# EAGLE design Mbus_1.3 (EAGLE 9.6.2)
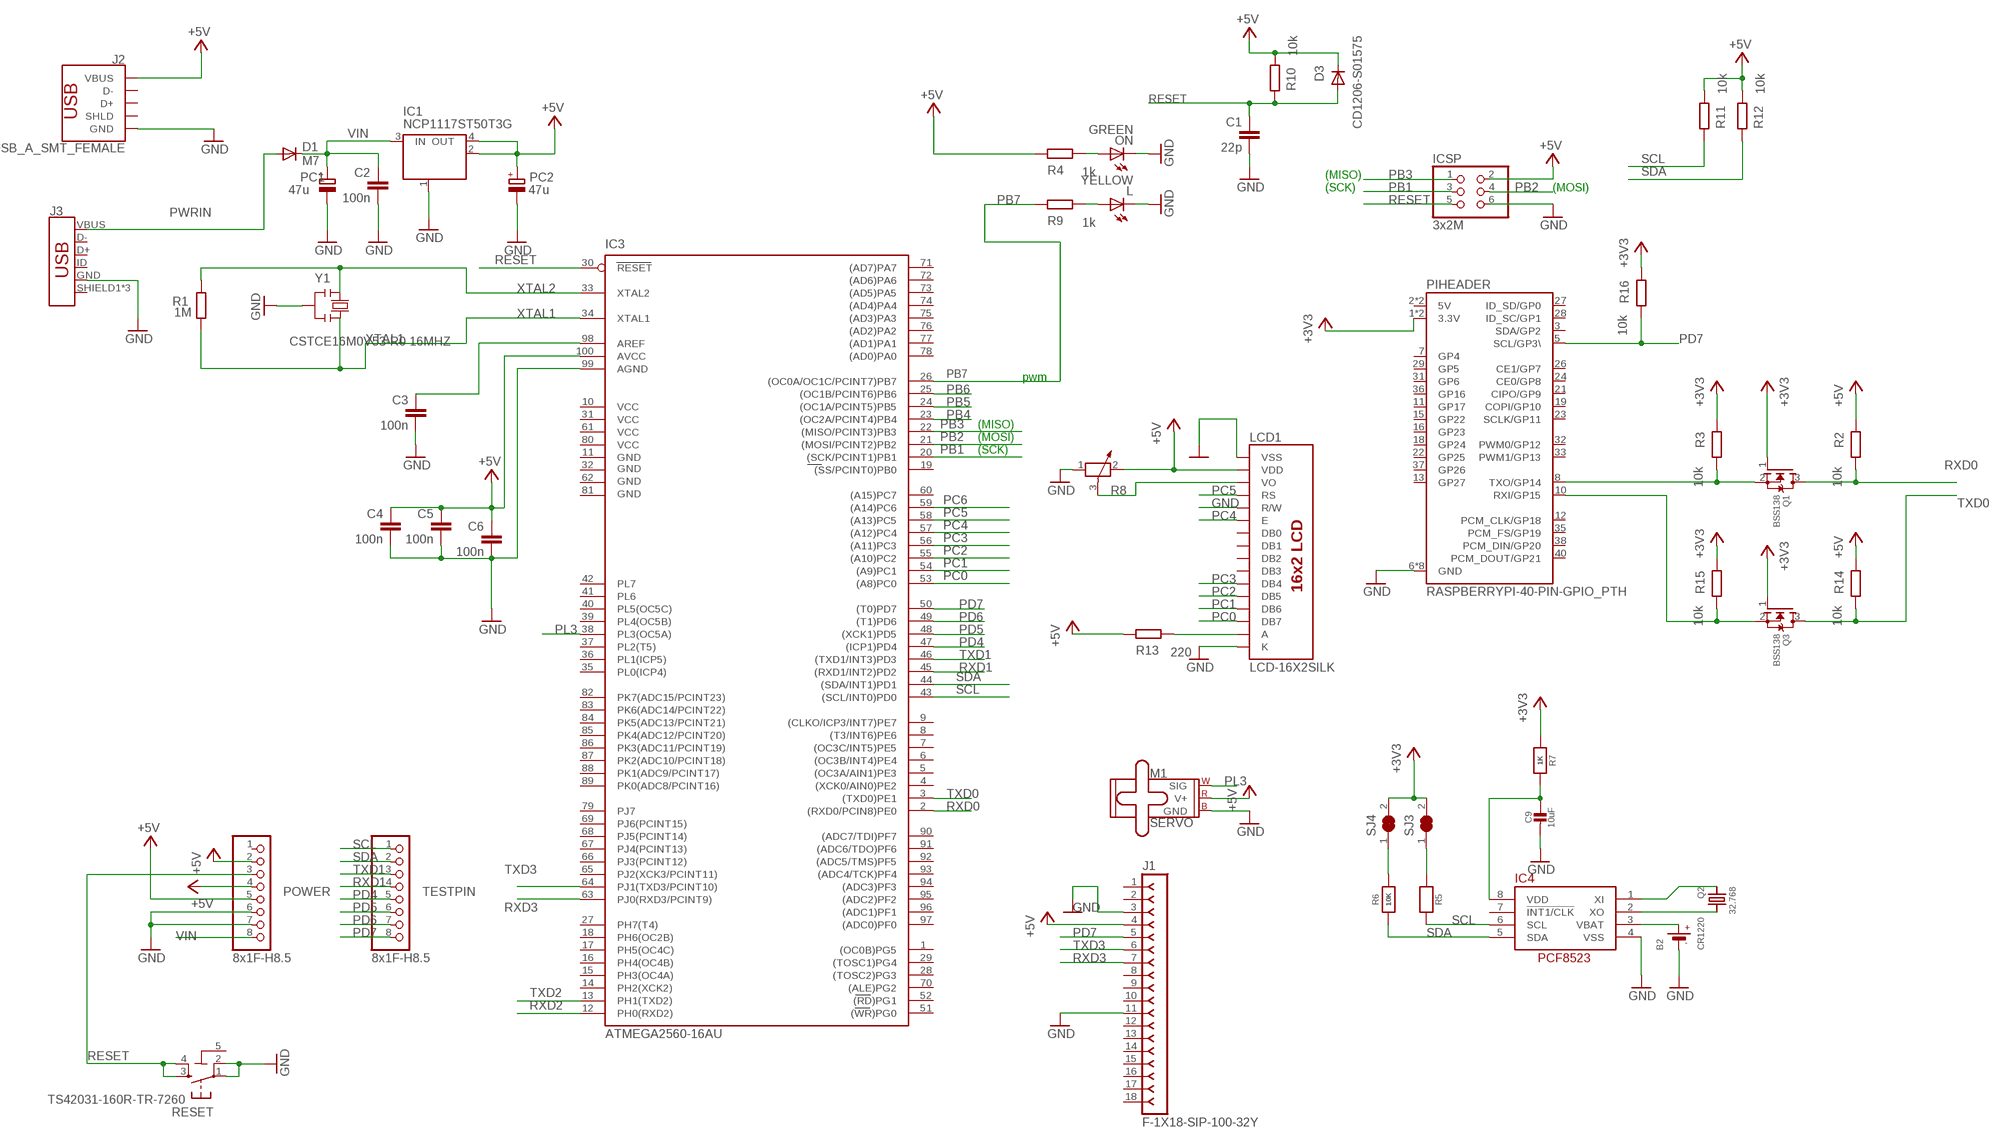
[diagram p0: schematic, sheet 1]

## Parts
B2  CR1220  BATTERYCR1220_SMT  [CR1220]
C1  22p  C-EU0603-RND  [C0603-ROUND]
C2  100n  C-EU0603-RND  [C0603-ROUND]
C3  100n  C-EU0603-RND  [C0603-ROUND]
C4  100n  C-EU0603-RND  [C0603-ROUND]
C5  100n  C-EU0603-RND  [C0603-ROUND]
C6  100n  C-EU0603-RND  [C0603-ROUND]
C9  10uF  CAP_CERAMIC0805-NOOUTLINE  [0805-NO]
D1  M7  DIODE-SMB  [SMB]
D3  CD1206-S01575  DIODE-MINIMELF  [MINIMELF]
IC1  NCP1117ST50T3G  MC33269ST-3.3T3  [SOT223]
IC3  ATMEGA2560-16AU  ATMEGA25602560-16AU  [TQFP100]
IC4  RTC_PCF8523T  [SOIC8_150MIL]
ICSP  3x2M  PINHD-2X3  [2X03]
J1  F-1X18-SIP-100-32Y  [SIP-100-18-32Y]
J2  USB_A_SMT_FEMALE  [USB-A-S-SILK-FEMALE]
J3  USB_MICRO-B_FEMALE-SMT  [USB-B-MICRO-SMD]
L  YELLOW  LEDCHIP-LED0805  [CHIP-LED0805]
LCD1  LCD-16X2SILK  [LCD-16X2]
M1  SERVO  [1X03]
ON  GREEN  LEDCHIP-LED0805  [CHIP-LED0805]
PC1  47u  CPOL-EUD  [PANASONIC_D]
PC2  47u  CPOL-EUD  [PANASONIC_D]
PIHEADER  RASPBERRYPI-40-PIN-GPIO_PTH  [2X20_SHROUDED]
POWER  8x1F-H8.5  PINHD-1X8  [1X08]
Q1  BSS138  MOSFET-NREFLOW  [SOT23]
Q2  32.768  CRYSTAL8.0X3.8  [CRYSTAL_8X3.8]
Q3  BSS138  MOSFET-NREFLOW  [SOT23]
R1  1M  R-EU_R0603  [R0603-ROUND]
R2  10k  R-EU_R0603  [R0603-ROUND]
R3  10k  R-EU_R0603  [R0603-ROUND]
R4  1k  R-EU_R0603  [R0603-ROUND]
R5  10K  RESISTOR0805_NOOUTLINE  [0805-NO]
R6  10K  RESISTOR0805_NOOUTLINE  [0805-NO]
R7  1K  RESISTOR0805_NOOUTLINE  [0805-NO]
R8  POTENTIOMETER_PT-10  [PT-10]
R9  1k  R-EU_R0603  [R0603-ROUND]
R10  10k  R-EU_R0603  [R0603-ROUND]
R11  10k  R-EU_R0603  [R0603-ROUND]
R12  10k  R-EU_R0603  [R0603-ROUND]
R13  220  R-EU_R0603  [R0603-ROUND]
R14  10k  R-EU_R0603  [R0603-ROUND]
R15  10k  R-EU_R0603  [R0603-ROUND]
R16  10k  R-EU_R0603  [R0603-ROUND]
RESET  TS42031-160R-TR-7260  TS42  [TS42]
SJ3  SOLDERJUMPER_CLOSED  [SOLDERJUMPER_CLOSEDWIRE]
SJ4  SOLDERJUMPER_CLOSED  [SOLDERJUMPER_CLOSEDWIRE]
TESTPIN  8x1F-H8.5  PINHD-1X8  [1X08]
Y1  CSTCE16M0V53-R0 16MHZ  RESONATORMU  [RESONATOR]

## Nets
+3V3: PIHEADER.1(3.3V) PIHEADER.17(3.3V) Q1.1(G) Q3.1(G) R3.2 R7.1 R15.2 R16.2 SJ3.2 SJ4.2
+5V [power usb]: C4.1 C5.1 C6.1 D3.C IC1.2(OUT) IC1.4(OUT) IC3.100(AVCC) ICSP.2 J1.4 J2.VBUS LCD1.2(VDD) M1.2(V+) PC2.+ POWER.2 POWER.4 POWER.5 R2.2 R4.2 R8.2 R10.1 R11.1 R12.1 R13.2 R14.2
AREF: C3.1 IC3.98(AREF)
GND [gnd]: B2.- C1.2 C2.2 C3.2 C4.2 C5.2 C6.2 C9.2 IC1.1(GND/ADJ) IC3.99(AGND) IC4.4(VSS) ICSP.6 J1.3 J1.11 J2.GND J3.GND L.C LCD1.1(VSS) LCD1.5(R/W) LCD1.16(K) M1.3(GND) ON.C PC1.- PC2.- PIHEADER.6(GND) PIHEADER.9(GND) PIHEADER.14(GND) PIHEADER.20(GND) PIHEADER.25(GND) PIHEADER.30(GND) PIHEADER.34(GND) PIHEADER.39(GND) POWER.6 POWER.7 R8.1 RESET.1 RESET.2 Y1.2
N$2: L.A R9.1
N$3: ON.A R4.1
N$6: IC4.1(XI) Q2.P$1
N$7: IC4.2(XO) Q2.P$4
N$8: R5.1 SJ3.1
N$9: R6.2 SJ4.1
N$10: C9.1 IC4.8(VDD) R7.2
N$11: LCD1.15(A) R13.1
N$22: LCD1.3(VO) R8.3
PB1: IC3.20((SCK/PCINT1)PB1) ICSP.3
PB2: IC3.21((MOSI/PCINT2)PB2) ICSP.4
PB3: IC3.22((MISO/PCINT3)PB3) ICSP.1
PB4: IC3.23((OC2A/PCINT4)PB4)
PB5: IC3.24((OC1A/PCINT5)PB5)
PB6: IC3.25((OC1B/PCINT6)PB6)
PB7: IC3.26((OC0A/OC1C/PCINT7)PB7) R9.2
PC0: IC3.53((A8)PC0) LCD1.14(DB7)
PC1: IC3.54((A9)PC1) LCD1.13(DB6)
PC2: IC3.55((A10)PC2) LCD1.12(DB5)
PC3: IC3.56((A11)PC3) LCD1.11(DB4)
PC4: IC3.57((A12)PC4) LCD1.6(E)
PC5: IC3.58((A13)PC5) LCD1.4(RS)
PC6: IC3.59((A14)PC6)
PD4: IC3.47((ICP1)PD4) TESTPIN.5
PD5: IC3.48((XCK1)PD5) TESTPIN.6
PD6: IC3.49((T1)PD6) TESTPIN.7
PD7: IC3.50((T0)PD7) J1.5 PIHEADER.5(SCL/GP3\) R16.1 TESTPIN.8
PL3: IC3.38(PL3(OC5A)) M1.1(SIG)
PWRIN [power]: D1.A J3.VBUS
RESET: C1.1 D3.A IC3.30(RESET) ICSP.5 POWER.3 R10.2 RESET.3 RESET.4
RXD0: IC3.2((RXD0/PCIN8)PE0) PIHEADER.10(RXI/GP15) Q1.3(D) Q3.2(S) R2.1 R15.1
RXD1: IC3.45((RXD1/INT2)PD2) TESTPIN.4
RXD2: IC3.12(PH0(RXD2))
RXD3: IC3.63(PJ0(RXD3/PCINT9)) J1.7
SCL: IC3.43((SCL/INT0)PD0) IC4.6(SCL) R5.2 R11.2 TESTPIN.1
SDA: IC3.44((SDA/INT1)PD1) IC4.5(SDA) R6.1 R12.2 TESTPIN.2
TXD0: IC3.3((TXD0)PE1) PIHEADER.8(TXO/GP14) Q1.2(S) Q3.3(D) R3.1 R14.1
TXD1: IC3.46((TXD1/INT3)PD3) TESTPIN.3
TXD2: IC3.13(PH1(TXD2))
TXD3: IC3.64(PJ1(TXD3/PCINT10)) J1.6
VBAT1: B2.+$1(+) IC4.3(VBAT)
VIN [power]: C2.1 D1.C IC1.3(IN) PC1.+ POWER.8
XTAL1: IC3.34(XTAL1) R1.1 Y1.3
XTAL2: IC3.33(XTAL2) R1.2 Y1.1
Unconnected: IC3.1((OC0B)PG5) IC3.4((XCK0/AIN0)PE2) IC3.5((OC3A/AIN1)PE3) IC3.6((OC3B/INT4)PE4) IC3.7((OC3C/INT5)PE5) IC3.8((T3/INT6)PE6) IC3.9((CLKO/ICP3/INT7)PE7) IC3.14(PH2(XCK2)) IC3.15(PH3(OC4A)) IC3.16(PH4(OC4B)) IC3.17(PH5(OC4C)) IC3.18(PH6(OC2B)) IC3.19((SS/PCINT0)PB0) IC3.27(PH7(T4)) IC3.28((TOSC2)PG3) IC3.29((TOSC1)PG4) IC3.35(PL0(ICP4)) IC3.36(PL1(ICP5)) IC3.37(PL2(T5)) IC3.39(PL4(OC5B)) IC3.40(PL5(OC5C)) IC3.41(PL6) IC3.42(PL7) IC3.51((WR)PG0) IC3.52((RD)PG1) IC3.60((A15)PC7) IC3.65(PJ2(XCK3/PCINT11)) IC3.66(PJ3(PCINT12)) IC3.67(PJ4(PCINT13)) IC3.68(PJ5(PCINT14)) IC3.69(PJ6(PCINT15)) IC3.70((ALE)PG2) IC3.71((AD7)PA7) IC3.72((AD6)PA6) IC3.73((AD5)PA5) IC3.74((AD4)PA4) IC3.75((AD3)PA3) IC3.76((AD2)PA2) IC3.77((AD1)PA1) IC3.78((AD0)PA0) IC3.79(PJ7) IC3.82(PK7(ADC15/PCINT23)) IC3.83(PK6(ADC14/PCINT22)) IC3.84(PK5(ADC13/PCINT21)) IC3.85(PK4(ADC12/PCINT20)) IC3.86(PK3(ADC11/PCINT19)) IC3.87(PK2(ADC10/PCINT18)) IC3.88(PK1(ADC9/PCINT17)) IC3.89(PK0(ADC8/PCINT16)) IC3.90((ADC7/TDI)PF7) IC3.91((ADC6/TDO)PF6) IC3.92((ADC5/TMS)PF5) IC3.93((ADC4/TCK)PF4) IC3.94((ADC3)PF3) IC3.95((ADC2)PF2) IC3.96((ADC1)PF1) IC3.97((ADC0)PF0) IC4.7(!INT1/CLK) J1.1 J1.2 J1.8 J1.9 J1.10 J1.12 J1.13 J1.14 J1.15 J1.16 J1.17 J1.18 J2.D+ J2.D- J2.SHLD1(SHLD) J2.SHLD2(SHLD) J3.D+ J3.D- J3.ID J3.SHIELD1(SHIELD) J3.SHIELD2(SHIELD) J3.SHIELD3(SHIELD) LCD1.7(DB0) LCD1.8(DB1) LCD1.9(DB2) LCD1.10(DB3) PIHEADER.3(SDA/GP2) PIHEADER.7(GP4) PIHEADER.11(GP17) PIHEADER.12(PCM_CLK/GP18) PIHEADER.13(GP27) PIHEADER.15(GP22) PIHEADER.16(GP23) PIHEADER.18(GP24) PIHEADER.19(COPI/GP10) PIHEADER.21(CIPO/GP9) PIHEADER.22(GP25) PIHEADER.23(SCLK/GP11) PIHEADER.24(CE0/GP8) PIHEADER.26(CE1/GP7) PIHEADER.27(ID_SD/GP0) PIHEADER.28(ID_SC/GP1) PIHEADER.29(GP5) PIHEADER.31(GP6) PIHEADER.32(PWM0/GP12) PIHEADER.33(PWM1/GP13) PIHEADER.35(PCM_FS/GP19) PIHEADER.36(GP16) PIHEADER.37(GP26) PIHEADER.38(PCM_DIN/GP20) PIHEADER.40(PCM_DOUT/GP21) POWER.1

## Notes on the sheet
- (MISO)
- (SCK) | (MOSI)
- pwm
- (MISO)
- (MOSI)
- (SCK)

## Power pins joined to a net without a drawn wire
5-GND: RESET.5(5-GND)
5V: PIHEADER.2(5V) PIHEADER.4(5V)
GND: IC3.11(GND)
GND1: IC3.32(GND1)
GND2: IC3.62(GND2)
GND3: IC3.81(GND3)
VCC: IC3.10(VCC)
VCC1: IC3.31(VCC1)
VCC2: IC3.61(VCC2)
VCC3: IC3.80(VCC3)

## Library data of the parts
B2 = microbuilder:BATTERY: CR1220 SMT - Digikey: 3001K-ND CD2032 BAT-HLD-001 - Digikey: BAT-HLD-001-ND
C1-C6 = SmartPrj:C-EU: CAPACITOR, European symbol
C9 = microbuilder:CAP_CERAMIC: Ceramic Capacitors For new designs, use the packages preceded by an '_' character since they are more reliable: The following footprints should be used on most boards: _0402 - Standard footprint for regular board layouts _0603 - Standard footprint for regular board layouts _0805 - Standard footprint for regular board layouts _1206 - Standard footprint for regular board layouts For extremely tight-pitch boards where space is at a premium, the following 'micro-pitch' footprints can be used (smaller pads, no silkscreen outline, etc.): _0402MP - Micro-pitch footprint for very dense/compact boards _0603MP - Micro-pitch footprint for very dense/compact boards _0805MP - Micro-pitch footprint for very dense/compact boards _1206MP - Micro-pitch footprint for very dense/compact boards
D1 D3 = diode:DIODE-: DIODE
IC1 = linear:MC33269ST*: Adjustable Output Low Dropout Voltage Regulator 800 mA Source: http://www.onsemi.com/pub/Collateral/MC33269-D.PDF
IC3 = SmartPrj:ATMEGA2560: MICROCONTROLLER 64/128/256 Kbytes FLASH 4 Kbytes EEPROM 8 Kbytes SRAM 86 General Purpose I/O pins 12-channels16-bit PWM 4 x Serial USARTs 16-channels 10-bit A/D
IC4 = microbuilder:RTC_PCF8523
ICSP = SmartPrj:PINHD-2X3: PIN HEADER
J1 = con-headers-jp:F-1X18-: FEMALE HEADER
J2 = SparkFun-Connectors:USB_A: USB-A Connector Male and female variants, as well as PTH and SMT variants SparkFun Products: SparkFun XBee Explorer Dongle <https://www.sparkfun.com/products/11697> PTH Male SparkFun MicroView-USB Programmer <https://www.sparkfun.com/products/12924> SMT Male SparkFun USB Type A Female Breakout <https://www.sparkfun.com/products/12700> SMT Female; PROD_ID: CONN-09520; SF_ID: PRT-09011
J3 = SparkFun-Connectors:USB_MICRO-B: USB Type Micro-B Connector Male/female and PTH/SMT variants SparkFun Products: SparkFun microB USB Breakout <https://www.sparkfun.com/products/12035> SparkFun USB microB Plug Breakout <https://www.sparkfun.com/products/10031> SparkFun ESP8266 Thing <https://www.sparkfun.com/products/13231>; PROD_ID: CONN-11752
L ON = led:LED: LED OSRAM: - CHIPLED LG R971, LG N971, LY N971, LG Q971, LY Q971, LO R971, LY R971 LH N974, LH R974 LS Q976, LO Q976, LY Q976 LO Q996 - Hyper CHIPLED LW Q18S LB Q993, LB Q99A, LB R99A - SideLED LS A670, LO A670, LY A670, LG A670, LP A670 LB A673, LV A673, LT A673, LW A673 LH A674 LY A675 LS A676, LA A676, LO A676, LY A676, LW A676 LS A679, LY A679, LG A679 - Hyper Micro SIDELED® LS Y876, LA Y876, LO Y876, LY Y876 LT Y87S - SmartLED LW L88C, LW L88S LB L89C, LB L89S, LG L890 LS L89K, LO L89K, LY L89K LS L896, LA L896, LO L896, LY L896 - TOPLED LS T670, LO T670, LY T670, LG T670, LP T670 LSG T670, LSP T670, LSY T670, LOP T670, LYG T670 LG T671, LOG T671, LSG T671 LB T673, LV T673, LT T673, LW T673 LH T674 LS T676, LA T676, LO T676, LY T676, LB T676, LH T676, LSB T676, LW T676 LB T67C, LV T67C, LT T67C, LS T67K, LO T67K, LY T67K, LW E67C LS E67B, LA E67B, LO E67B, LY E67B, LB E67C, LV E67C, LT E67C LW T67C LS T679, LY T679, LG T679 LS T770, LO T770, LY T770, LG T770, LP T770 LB T773, LV T773, LT T773, LW T773 LH T774 LS E675, LA E675, LY E675, LS T675 LS T776, LA T776, LO T776, LY T776, LB T776 LHGB T686 LT T68C, LB T68C - Hyper Mini TOPLED® LB M676 - Mini TOPLED Santana® LG M470 LS M47K, LO M47K, LY M47K Source: http://www.osram.convergy.de LUXEON: - LUMILED® LXK2-PW12-R00, LXK2-PW12-S00, LXK2-PW14-U00, LXK2-PW14-V00 LXK2-PM12-R00, LXK2-PM12-S00, LXK2-PM14-U00 LXK2-PE12-Q00, LXK2-PE12-R00, LXK2-PE12-S00, LXK2-PE14-T00, LXK2-PE14-U00 LXK2-PB12-K00, LXK2-PB12-L00, LXK2-PB12-M00, LXK2-PB14-N00, LXK2-PB14-P00, LXK2-PB14-Q00 LXK2-PR12-L00, LXK2-PR12-M00, LXK2-PR14-Q00, LXK2-PR14-R00 LXK2-PD12-Q00, LXK2-PD12-R00, LXK2-PD12-S00 LXK2-PH12-R00, LXK2-PH12-S00 LXK2-PL12-P00, LXK2-PL12-Q00, LXK2-PL12-R00 Source: www.luxeon.com KINGBRIGHT: KA-3528ASYC Source: www.kingbright.com
LCD1 = SparkFun-Displays:LCD-16X2: Standard text-only 16x2 parallel input LCD Basic 16 character by 2 line display. Typically utilizes the extremely common HD44780 parallel interface chipset SparkFun Products: Basic 16x2 Green <https://www.sparkfun.com/products/255> Basic 8x2 Green <https://www.sparkfun.com/products/11122>; PROD_ID: LCD-12633; SF_ID: LCD-00255
M1 = SparkFun-Electromechanical:SERVO: Servo Motor 3-pin connector for a standard servo motor (voltage supply, ground, and control signal.) SparkFun Products Servo - Generic (Sub-Micro Size) <https://www.sparkfun.com/products/9065> (ROB-09065) Servo - Generic High Torque Continuous Rotation (Standard Size) <https://www.sparkfun.com/products/9347> (ROB-09347) Servo - Generic High Torque (Standard Size) <https://www.sparkfun.com/products/11965> (ROB-11965)
PC1 PC2 = rcl:CPOL-EU: POLARIZED CAPACITOR, European symbol
PIHEADER = SparkFun-Connectors:RASPBERRYPI-40-PIN-GPIO: Raspberry Pi GPIO Header 2x20 pin connector, as found on B, B+, A+ models. Both shrouded PTH and SMT versions available. SparkFun Products: GPIO Shrouded Header <https://www.sparkfun.com/products/13054>- PTH SparkFun Pi Wedge (Preassembled) <https://www.sparkfun.com/products/13717>; PROD_ID: CONN-12263; SF_ID: PRT-13054
POWER TESTPIN = SmartPrj:PINHD-1X8: PIN HEADER
Q1 Q3 = adafruit:MOSFET-N: N-Channel Mosfet 2N7002E - 60V 260mA SOT23 [Digikey: 2N7002ET1GOSTR-ND] - REEL BSH103 - 30V 850mA SOT23 [Digikey: 568-5013-1-ND]
Q2 = microbuilder:CRYSTAL: Crystals HC49UP - Surface Mount Crystal 4.0MHz 18pF +/-30ppm Surface Mount Crystal [Digikey: 535-9857-1-ND] 12.0 MHz Surface Mount Crystal [Digikey: 535-9869-6-ND] 25.0 MHz Surface Mount Crystal [Digikey: 535-9078-1-ND] 2.5 x 2.0mm - MEMs SMT Crystal 16.0 MHz 10pF 20ppm 2.5 x 2.0mm Crystal [Digikey -40-85°C: 535-10923-1-ND] 3.2 x 2.5mm - MEMs SMT Crystal 12.0 MHz 8pF 15ppm 3.2 x 2.5mm Crystal [Digikey: -10-70°C: 644-1047-1-ND -40-125°C: 644-1128-1-ND] 40~85°C cheaper: 644-1173-6-ND 16.0 MHz 8pF 15ppm 3.2 x 2.5mm Crystal [Digikey: -10-70°C: 644-1049-1-ND -40-125°C: 644-1129-2-ND]-40~85°C cheaper: 644-1175-6-ND 16.0 MHz 10pF 10ppm 3.2 x 2.5mm Crystal [Digikey: 644-1100-1-ND] 27.12 MHz 18pF 30ppm 3.2 x 2.5mm Crystal [Digikey: 887-1424-1-ND] 27.12MHz 10pF 10ppm 3.2 x 2.5mm Crystal [Digikey: 887-1329-1-ND] 4.9 x 1.8mm - MEMs SMT Crystal 32.768 KHz 12.5pF 20ppm 4.9 x 1.8mm Crystal [Digikey: SE2415CT-ND] 8.0 x 3.8mm - Surface Mount Crystal 32.768kHz 12.5pF 20ppm -40°C-85°C [Digikey: 535-9166-2-ND] Cylinder 32.768KHz Cylinder Crystal (2x6mm body) [Ex. Digikey: 300-8341-2-ND]
R1-R4 R9-R16 = SmartPrj:R-EU_: RESISTOR, European symbol
R5-R7 = microbuilder:RESISTOR: Resistors For new designs, use the packages preceded by an '_' character since they are more reliable: The following footprints should be used on most boards: _0402 - Standard footprint for regular board layouts _0603 - Standard footprint for regular board layouts _0805 - Standard footprint for regular board layouts _1206 - Standard footprint for regular board layouts For extremely tight-pitch boards where space is at a premium, the following 'micro-pitch' footprints can be used (smaller pads, no silkscreen outline, etc.): _0402MP - Micro-pitch footprint for very dense/compact boards _0603MP - Micro-pitch footprint for very dense/compact boards _0805MP - Micro-pitch footprint for very dense/compact boards _1206MP - Micro-pitch footprint for very dense/compact boards
R8 = rcl@1:POTENTIOMETER_: Potentiometer; SPICEMODEL: POT; SPICEPREFIX: X
RESET = SmartPrj:TS42: TS42 Dongnan Electronics Tact switch VDC 12V - 50mA
SJ3 SJ4 = microbuilder:SOLDERJUMPER_CLOSED: Solder Jumper - Closed These solder jumpers are closed by default CLOSEDWIRE - 10 mil trace between pads that can be cut and resoldered later CLOSEDPERM - 63 mil trace between pads for a permanent connection (used to 'bridge' two signals, a shameless hack for Eagle). Can double as a test point as well (no cream layer)
Y1 = SmartPrj:RESONATOR

## Net classes
0 default: width 0.203 mm, drill 0.406 mm, clearance 0.203 mm
1 power: width 0.61 mm, drill 0.406 mm, clearance 0.203 mm
2 gnd: width 0.305 mm, drill 0.406 mm, clearance 0.203 mm
3 power usb: width 0.508 mm, drill 0.406 mm, clearance 0.203 mm

## Board
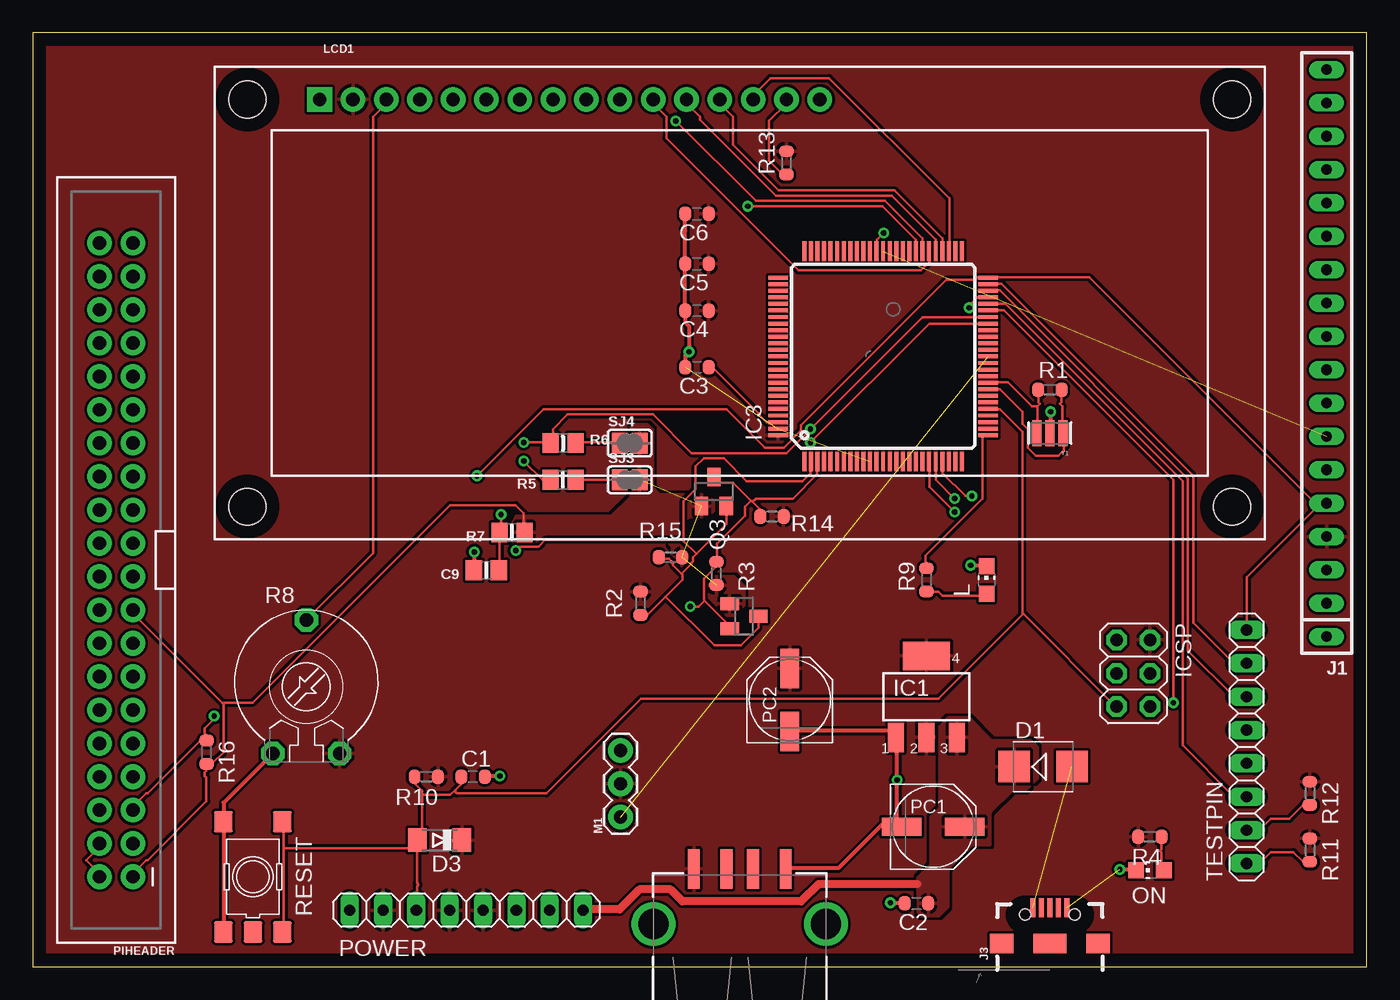
[diagram p1: board, top side]
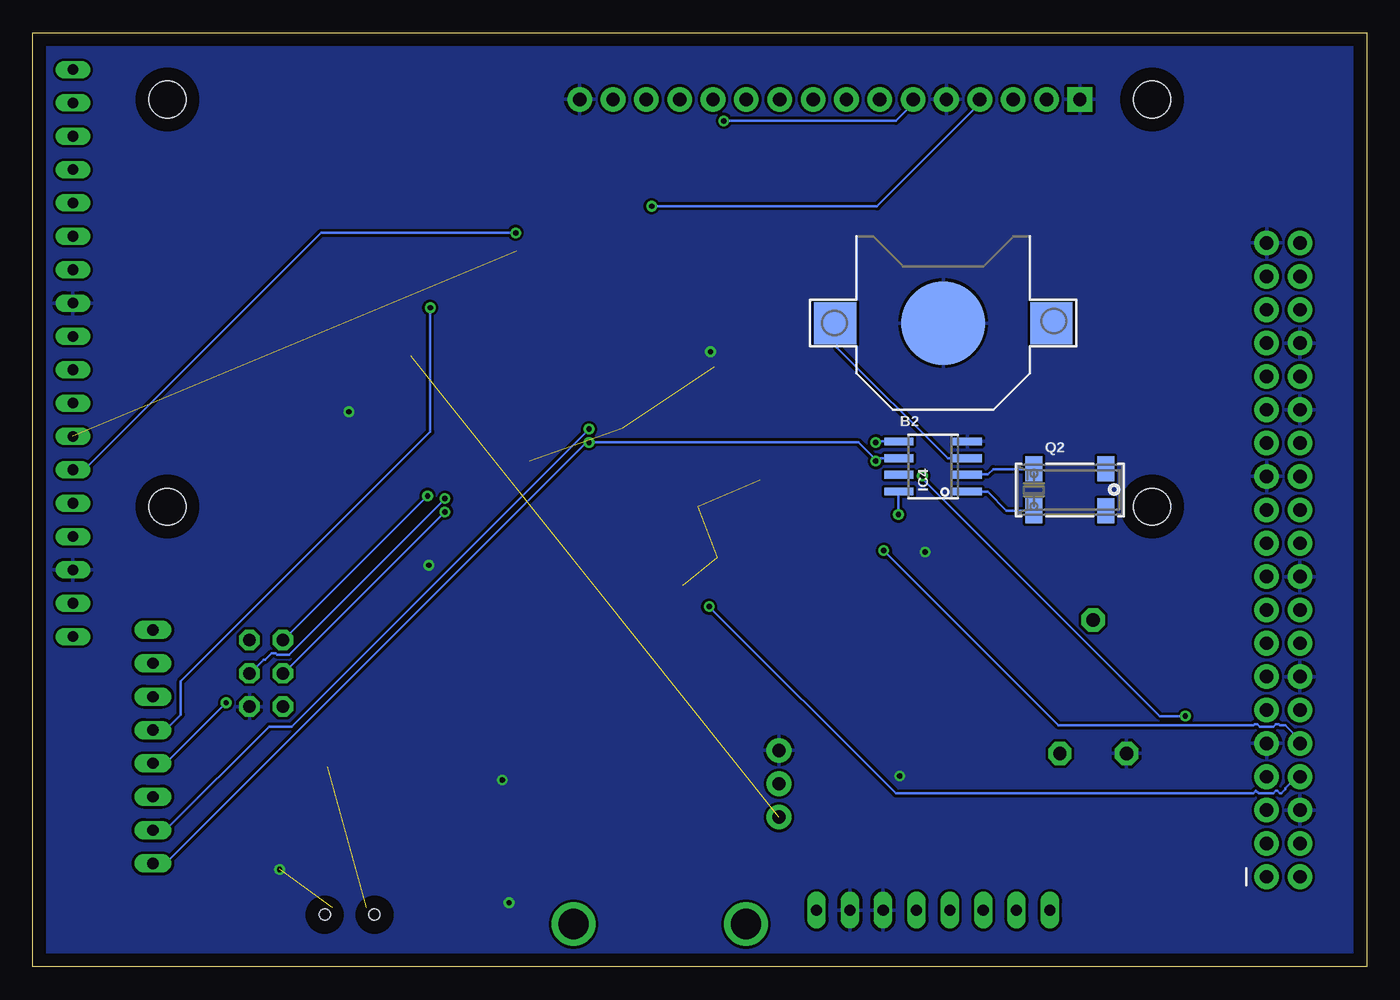
[diagram p2: board, bottom side, seen from below]

Size 101.6 x 71.12 mm. Coordinates in mm from the lower left corner, seen from the top.
Outline: 0,0 101.6,0 101.6,71.12 0,71.12 0,0
Copper layers (1*16): Top 0.035mm / dielectric 1.5mm / Bottom 0.035mm
Design rules "default": minimum track width 6mil, minimum drill 0.35mm, track to track 6mil, track to pad 6mil, pad to pad 6mil, via to via 6mil, smd to smd 6mil, copper to edge 40mil, drill to drill 6mil, minimum pad ring 10mil, minimum via ring 8mil, stop-mask expansion 4mil, vias tented up to drill 0mil, thermal gap 10mil

### Footprints (pad centres in the part's own frame; a part is rotated, then mirrored left to right if it is on the bottom)
CR1220 = smd 3.2 x 3.2: +$1 -8.225,0; +$2 8.225,0 | smd 6.35 x 6.35: - 0,0
C0603-ROUND = smd 0.898 x 1.1: 1 -0.889,0; 2 0.889,0
0805-NO = smd 1.24 x 1.5: 1 -0.95,0; 2 0.95,0
SMB = smd 2.4 x 2.4: A 2.2,0; C -2.2,0
MINIMELF = smd 1.4 x 1.8: A 1.7,0; C -1.7,0
SOT223 = smd 1.219 x 2.235: 1 -2.311,-3.099; 2 0,-3.099; 3 2.311,-3.099 | smd 3.6 x 2.2: 4 0,3.099
TQFP100 = smd 1.5 x 0.3: 1 -8,6; 2 -8,5.5; 3 -8,5; 4 -8,4.5; 5 -8,4; 6 -8,3.5; 7 -8,3; 8 -8,2.5; 9 -8,2; 10 -8,1.5; 11 -8,1; 12 -8,0.5; 13 -8,0; 14 -8,-0.5; 15 -8,-1; 16 -8,-1.5; 17 -8,-2; 18 -8,-2.5; 19 -8,-3; 20 -8,-3.5; 21 -8,-4; 22 -8,-4.5; 23 -8,-5; 24 -8,-5.5; 25 -8,-6; 51 8,-6; 52 8,-5.5; 53 8,-5; 54 8,-4.5; 55 8,-4; 56 8,-3.5; 57 8,-3; 58 8,-2.5; 59 8,-2; 60 8,-1.5; 61 8,-1; 62 8,-0.5; 63 8,0; 64 8,0.5; 65 8,1; 66 8,1.5; 67 8,2; 68 8,2.5; 69 8,3; 70 8,3.5; 71 8,4; 72 8,4.5; 73 8,5; 74 8,5.5; 75 8,6 | smd 0.3 x 1.5: 26 -6,-8; 27 -5.5,-8; 28 -5,-8; 29 -4.5,-8; 30 -4,-8; 31 -3.5,-8; 32 -3,-8; 33 -2.5,-8; 34 -2,-8; 35 -1.5,-8; 36 -1,-8; 37 -0.5,-8; 38 0,-8; 39 0.5,-8; 40 1,-8; 41 1.5,-8; 42 2,-8; 43 2.5,-8; 44 3,-8; 45 3.5,-8; 46 4,-8; 47 4.5,-8; 48 5,-8; 49 5.5,-8; 50 6,-8; 76 6,8; 77 5.5,8; 78 5,8; 79 4.5,8; 80 4,8; 81 3.5,8; 82 3,8; 83 2.5,8; 84 2,8; 85 1.5,8; 86 1,8; 87 0.5,8; 88 0,8; 89 -0.5,8; 90 -1,8; 91 -1.5,8; 92 -2,8; 93 -2.5,8; 94 -3,8; 95 -3.5,8; 96 -4,8; 97 -4.5,8; 98 -5,8; 99 -5.5,8; 100 -6,8
SOIC8_150MIL = smd 0.6 x 2.2: 1 -1.905,-2.6; 2 -0.635,-2.6; 3 0.635,-2.6; 4 1.905,-2.6; 5 1.905,2.6; 6 0.635,2.6; 7 -0.635,2.6; 8 -1.905,2.6
2X03 = drill 0.95 pad 1.55 octagon: 1 -2.54,-1.27; 2 -2.54,1.27; 3 0,-1.27; 4 0,1.27; 5 2.54,-1.27; 6 2.54,1.27
SIP-100-18-32Y = drill 0.813 long: 1 -21.59,0; 2 -19.05,0; 3 -16.51,0; 4 -13.97,0; 5 -11.43,0; 6 -8.89,0; 7 -6.35,0; 8 -3.81,0; 9 -1.27,0; 10 1.27,0; 11 3.81,0; 12 6.35,0; 13 8.89,0; 14 11.43,0; 15 13.97,0; 16 16.51,0; 17 19.05,0; 18 21.59,0
USB-A-S-SILK-FEMALE = smd 3 x 0.9: D+ 7.212,-1; D- 7.212,1; GND 7.212,-3.5; VBUS 7.212,3.5 | drill 2.311: SHLD1 3,-6.566; SHLD2 3,6.566
USB-B-MICRO-SMD = smd 1.45 x 0.4: D+ 2.725,0; D- 2.725,0.65; GND 2.725,-1.3; ID 2.725,-0.65; VBUS 2.725,1.3 | smd 1.5 x 1.8: SHIELD1 0,3.685; SHIELD2 0,-3.685 | smd 1.5 x 2.5: SHIELD3 0,0 | hole 0.85: 2.2,1.9; 2.2,-1.9
CHIP-LED0805 = smd 1.2 x 1.2: A 0,-1.05; C 0,1.05
LCD-16X2 = drill 1.016 pad 1.88 square: 1 -32,15.5 | drill 1.016 pad 1.88: 2 -29.46,15.5; 3 -26.92,15.5; 4 -24.38,15.5; 5 -21.84,15.5; 6 -19.3,15.5; 7 -16.76,15.5; 8 -14.22,15.5; 9 -11.68,15.5; 10 -9.14,15.5; 11 -6.6,15.5; 12 -4.06,15.5; 13 -1.52,15.5; 14 1.02,15.5; 15 3.56,15.5; 16 6.1,15.5 | hole 2.8: -37.5,15.5; -37.5,-15.5; 37.5,15.5; 37.5,-15.5
1X03 = drill 1.016 pad 1.88: 1 0,0; 2 2.54,0; 3 5.08,0
PANASONIC_D = smd 3 x 1.4: + 2.4,0; - -2.4,0
2X20_SHROUDED = drill 1.016 pad 1.88: 1 -1.27,24.13; 2 1.27,24.13; 3 -1.27,21.59; 4 1.27,21.59; 5 -1.27,19.05; 6 1.27,19.05; 7 -1.27,16.51; 8 1.27,16.51; 9 -1.27,13.97; 10 1.27,13.97; 11 -1.27,11.43; 12 1.27,11.43; 13 -1.27,8.89; 14 1.27,8.89; 15 -1.27,6.35; 16 1.27,6.35; 17 -1.27,3.81; 18 1.27,3.81; 19 -1.27,1.27; 20 1.27,1.27; 21 -1.27,-1.27; 22 1.27,-1.27; 23 -1.27,-3.81; 24 1.27,-3.81; 25 -1.27,-6.35; 26 1.27,-6.35; 27 -1.27,-8.89; 28 1.27,-8.89; 29 -1.27,-11.43; 30 1.27,-11.43; 31 -1.27,-13.97; 32 1.27,-13.97; 33 -1.27,-16.51; 34 1.27,-16.51; 35 -1.27,-19.05; 36 1.27,-19.05; 37 -1.27,-21.59; 38 1.27,-21.59; 39 -1.27,-24.13; 40 1.27,-24.13
1X08 = drill 0.85 pad 1.422 long: 1 -8.89,0; 2 -6.35,0; 3 -3.81,0; 4 -1.27,0; 5 1.27,0; 6 3.81,0; 7 6.35,0; 8 8.89,0
SOT23 = smd 1 x 1.4: 1 -0.95,-1.1; 2 0.95,-1.1; 3 0,1.1
CRYSTAL_8X3.8 = smd 1.3 x 1.9: P$1 -2.75,-1.6; P$2 2.75,-1.6; P$3 2.75,1.6; P$4 -2.75,1.6
R0603-ROUND = smd 0.898 x 1.1: 1 -0.889,0; 2 0.889,0
PT-10 = drill 1.016 pad 1.778 octagon: 1 -2.54,-5.08; 2 2.54,-5.08; 3 0,5.08
TS42 = smd 1.6 x 1.4: 1 -4.2,2.25; 2 4.2,2.25; 3 -4.2,-2.25; 4 4.2,-2.25; 5 -4.2,0
SOLDERJUMPER_CLOSEDWIRE = smd 1.168 x 1.6: 1 -0.762,0; 2 0.762,0 | smd 0.635 x 0.203: WIRE 0,0
RESONATOR = smd 0.7 x 2: 1 -1,0; 2 0,0; 3 1,0

### Placement (x,y rotation side)
B2  32.26,49.02 0 bottom
C1  33.53,14.48 0 top
C2  67.31,4.83 180 top
C3  50.59,45.65 180 top
C4  50.59,49.97 180 top
C5  50.59,53.53 180 top
C6  50.59,57.34 180 top
C9  34.54,30.2 180 top
D1  76.96,15.24 0 top
D3  30.99,9.65 180 top
IC1  68.07,20.57 0 top
IC3  64.77,46.48 90 top
IC4  33.02,38.1 90 bottom
ICSP  83.82,22.35 270 top
J1  98.55,46.74 90 top
J2  53.85,0.25 90 top
J3  77.47,1.78 90 top
L  72.64,29.46 0 top
LCD1  53.85,50.55 0 top
M1  44.77,11.4 90 top
ON  85.09,7.37 90 top
PC1  68.58,10.67 0 top
PC2  57.66,20.32 90 top
PIHEADER  6.35,30.99 180 top
POWER  33.02,4.32 0 top
Q1  54.17,26.7 270 top
Q2  22.61,36.32 0 bottom
Q3  51.87,36.19 0 top
R1  77.47,43.94 0 top
R2  46.29,27.68 90 top
R3  52.06,29.96 270 top
R4  85.09,9.91 180 top
R5  40.39,37.08 180 top
R6  40.39,39.88 0 top
R7  36.5,33.08 180 top
R8  20.83,21.34 0 top
R9  68.07,29.46 90 top
R10  29.97,14.48 180 top
R11  97.28,8.89 270 top
R12  97.28,13.21 270 top
R13  57.4,61.21 90 top
R14  56.3,34.29 0 top
R15  48.56,31.19 0 top
R16  13.23,16.34 270 top
RESET  16.76,6.86 90 top
SJ3  45.47,37.08 0 top
SJ4  45.47,39.88 0 top
TESTPIN  92.46,16.76 90 top
Y1  77.47,40.64 180 top

### Tracks (layer width: path | path; a pad name or v marks a point on that pad's centre or on a via)
5V
  Top 0.203: PIHEADER.2 5.08,7.11 4.06,8.13 5.08,9.14 PIHEADER.4
+3V3  (3 unrouted)
  Top 0.203: PIHEADER.1 7.62,7.11 8.64,8.13 8.74,8.13 13.21,12.6 13.21,14.43 13.11,14.53 13.11,14.83 13.21,14.94 13.21,15.44 R16.2 13.31,15.54 13.72,15.54 14.53,16.36 14.53,20.02 14.48,20.07 | PIHEADER.17 7.62,26.92 14.48,20.07 | R7.1 37.39,33.12 37.39,34.54 36.78,35.15 31.8,35.15 16.76,20.12 14.53,20.12 14.48,20.07
  pour Top: 36.54,33.91 36.54,32.03 36.8,31.78 38.38,31.78 39.1,32.49 48.18,32.49 48.66,32 48.66,30.21 50.03,28.85 50.03,27.43 50.73,26.73 53.44,26.73 54.23,27.52 54.23,28.96 53.43,29.76 50.54,29.76 50.22,30.07 50.22,31.95 49.63,32.54 49.63,33.82 50.03,34.22 51.42,34.22 51.93,34.73 51.93,35.44 51.39,35.98 47.78,35.98 47.27,36.49 47.27,40.89 46.85,41.32 45.74,41.32 45.51,41.09 45.51,35.81 44.04,34.33 36.76,34.33 36.76,34.3
+5V
  pour Top (rank 2): -5.59,74.68 -5.59,-6.1 105.41,-6.1 105.92,-5.59 105.92,75.18 106.17,75.44 -4.83,75.44
AREF
  Top 0.203: C3.1 51.51,45.62 51.82,45.62 55.27,42.16 55.27,42.06 55.88,41.45 56.69,41.45 IC3.98
GND  (via drill 0.41)  (3 unrouted)
  Top 0.305: J2.GND 57.4,7.52 61.37,7.52 64.82,10.97 65.73,10.97 PC1.- 66.14,10.67 65.84,10.97 v65.84,14.22 65.84,17.48 IC1.1 65.73,17.58 65.33,17.98 57.71,17.98 PC2.- | C3.2 49.68,45.72 49.68,46.53 v49.99,46.84 49.99,48.77 49.68,49.07 49.68,49.89 C4.2 49.68,50.09 49.68,53.44 C5.2 49.68,53.65 49.68,56.08 49.58,56.19 49.68,56.29 49.68,57.3 C6.2 | RESET.1 14.53,2.74 14.53,10.97 RESET.2 14.53,11.18 14.53,12.5 R8.1 | v35.56,14.53 34.44,14.53 C1.2 | v65.33,4.88 66.34,4.88 C2.2 | v82.8,7.42 84.02,7.42 ON.C | v71.42,30.58 72.64,30.58 L.C | v33.63,31.6 33.63,30.28 C9.2 | v77.52,42.27 77.52,40.64 Y1.2
  pour Bottom: -10.92,79.5 -10.92,-10.92 -9.91,-11.94 110.24,-11.94 110.24,80.52 110.74,81.03 -9.4,81.03
N$2
  Top 0.203: R9.1 68.07,28.55 68.99,28.55 69.29,28.25 72.54,28.25 72.64,28.35 L.A
N$3
  Top 0.203: R4.1 85.95,9.86 85.95,8.94 85.85,8.84 85.95,8.74 85.95,7.52 86.06,7.42 ON.A
N$6
  Bottom 0.203: Q2.P$1 25.4,34.75 27.43,34.75 28.85,36.17 30.38,36.17 IC4.1
N$7
  Bottom 0.203: Q2.P$4 25.4,37.9 28.45,37.9 28.85,37.49 30.38,37.49 IC4.2
N$8
  Top 0.203: SJ3.1 R5.1
N$9
  Top 0.203: R6.2 41.35,39.93 44.7,39.93 SJ4.1
N$10  (via drill 0.41)
  Top 0.203: C9.1 35.56,30.28 35.56,33.02 R7.2 35.66,33.02 v35.66,34.44
  Bottom 0.203: v35.66,34.44 35.66,36.17 IC4.8
N$11
  Top 0.203: R13.1 57.4,60.35 57.1,60.35 56.08,61.37 56.08,64.41 57.4,65.73 LCD1.15
N$22
  Top 0.203: R8.3 25.91,31.5 25.91,64.72 26.92,65.73 LCD1.3
PB1  (via drill 0.41)
  Top 0.203: v70.21,34.65 68.28,36.58 68.28,38.41 IC3.20
  Bottom 0.203: v70.21,34.65 82.5,22.35 ICSP.3
PB2  (via drill 0.41)
  Top 0.203: v70.21,35.66 68.78,37.08 68.78,38.41 IC3.21
  Bottom 0.203: v70.21,35.66 82.09,23.77 83.01,23.77 83.11,23.88 83.41,23.88 83.92,23.37 84.02,23.37 85.04,22.35 ICSP.4
PB3  (via drill 0.41)
  Top 0.203: v71.53,35.87 71.02,35.87 69.29,37.59 69.29,38.41 IC3.22
  Bottom 0.203: v71.53,35.87 82.5,24.89 ICSP.1
PB7
  Top 0.203: R9.2 68.07,30.79 67.97,30.89 67.97,31.29 72.34,35.66 72.34,40.34 72.44,40.44 72.75,40.44 IC3.26
PC0
  Top 0.203: IC3.53 69.8,54.56 69.8,58.52 60.66,67.67 56.19,67.67 54.97,66.45 54.97,66.14 LCD1.14
PC1
  Top 0.203: IC3.54 69.29,54.56 69.29,55.47 65.63,59.13 56.79,59.13 53.34,62.59 53.34,64.72 52.43,65.63 52.43,66.04 LCD1.13
PC2
  Top 0.203: IC3.55 68.78,54.56 68.78,55.37 65.43,58.73 56.59,58.73 50.8,64.52 50.8,64.72 49.89,65.63 49.89,66.04 LCD1.12
PC3
  Top 0.203: IC3.56 68.28,54.46 68.28,53.65 67.67,53.03 58.32,53.03 48.26,63.09 48.26,64.72 47.35,65.63 47.35,66.04 LCD1.11
PC4  (via drill 0.41)
  Top 0.203: v48.97,64.41 55.07,58.32 64.92,58.32 67.77,55.47 67.77,54.56 IC3.57
  Bottom 0.203: v48.97,64.41 35.87,64.41 34.65,65.63 34.65,66.04 LCD1.6
PC5  (via drill 0.41)
  Top 0.203: v54.46,57.91 64.72,57.91 67.26,55.37 67.26,54.56 IC3.58
  Bottom 0.203: v54.46,57.91 37.29,57.91 29.57,65.63 29.57,66.04 LCD1.4
PD4  (via drill 0.41)
  Top 0.203: v71.32,50.19 71.32,50.39 71.93,51 72.75,51 IC3.47
  Bottom 0.203: v71.32,50.19 71.32,40.74 90.32,21.74 90.32,19.2 91.44,18.09 92.46,18.09 TESTPIN.5
PD5
  Top 0.203: IC3.48 72.85,51.51 73.66,51.51 87.99,37.19 87.99,24.08 91.44,20.62 92.46,20.62 TESTPIN.6
PD6
  Top 0.203: IC3.49 72.85,52.02 73.76,52.02 88.39,37.39 88.39,26.21 91.44,23.16 92.46,23.16 TESTPIN.7
PD7  (via drill 0.41)
  Top 0.203: PIHEADER.5 7.62,12.19 8.64,13.21 8.74,13.21 12.7,17.17 13.21,17.17 R16.1 13.21,17.27 13.21,17.68 13.11,17.78 13.11,18.19 13.82,18.9 v13.82,19.1 | 97.64,35.36 80.47,52.53 72.85,52.53 IC3.50 72.75,52.53 71.93,52.53 71.73,52.32 69.6,52.32 58.52,41.25 58.52,40.84 57.2,39.52 55.78,39.52 52.83,42.47 38.91,42.47 v33.83,37.39 | 97.64,35.36 98.55,35.36 J1.5 97.64,35.36 | TESTPIN.8 92.46,29.67 97.64,34.85 97.64,35.36
  Bottom 0.203: v13.82,19.1 15.75,19.1 33.83,37.19 v33.83,37.39
PL3  (1 unrouted)
PWRIN  (1 unrouted)
RESET
  Top 0.203: 19.1,9.04 19.1,10.97 RESET.4 | 19.1,9.04 19.1,2.74 RESET.3 | 29.67,13.11 29.67,9.96 29.36,9.65 D3.A | 29.67,13.11 29.67,13.41 29.16,13.92 29.16,14.43 R10.2 | 32.16,13.46 31.8,13.11 29.67,13.11 | 32.16,13.46 32.61,13.92 32.61,14.43 C1.1 | 29.26,9.04 29.26,9.65 D3.A | 29.26,9.04 29.26,6.4 29.36,6.3 29.36,6.2 29.26,6.1 29.26,4.37 POWER.3 | 29.26,9.04 19.1,9.04 | 29.26,9.04 D3.A | 75.44,26.87 82.5,19.81 ICSP.5 | 75.44,26.87 75.39,26.92 75.39,40.74 73.66,42.47 72.85,42.47 IC3.30 | 75.44,26.87 68.99,20.42 46.33,20.42 39.12,13.21 32.31,13.21 32.21,13.31 32.21,13.41 32.16,13.46
RXD0  (via drill 0.41)
  Top 0.203: 48.21,28.19 49.48,29.46 49.48,29.87 49.43,29.92 | 48.21,28.19 46.84,26.82 46.33,26.82 R2.1 | 49.43,29.92 48.77,30.58 48.77,30.68 48.67,30.79 48.67,30.89 48.46,31.09 47.75,31.09 R15.1 | 48.21,28.19 51.92,24.49 53.95,24.49 55.27,25.81 55.27,26.62 Q1.3 | 50.55,31.45 50.29,31.19 50.29,30.89 50.19,30.79 50.19,30.68 49.43,29.92 | 50.55,31.45 52.83,33.73 52.83,35.05 Q3.2 | 49.58,32.51 49.58,32.41 50.55,31.45 | 49.58,32.51 49.58,35.46 50.49,36.37 50.49,38.1 51.1,38.71 52.63,38.71 54.36,36.98 58.62,36.98 59.23,37.59 59.23,38.41 IC3.2 | v36.78,31.7 37.08,32 38.51,32 39.01,32.51 49.58,32.51
  Bottom 0.203: PIHEADER.10 5.08,17.27 6.2,18.39 6.6,18.39 6.71,18.49 6.91,18.49 7.11,18.29 8.13,18.29 8.33,18.49 8.53,18.49 8.64,18.39 23.47,18.39 v36.78,31.7
RXD1  (via drill 0.41)
  Top 0.203: v86.87,20.12 86.87,37.08 73.97,49.99 72.85,49.99 IC3.45
  Bottom 0.203: v86.87,20.12 91.44,15.54 92.46,15.54 TESTPIN.4
RXD3  (1 unrouted)
SCL  (via drill 0.41)
  Top 0.203: R11.2 97.23,8.03 96.72,8.03 96.01,8.74 94.28,8.74 93.47,7.92 92.46,7.92 TESTPIN.1 | R5.2 38.81,37.08 v37.39,38.51 | v59.23,39.93 68.28,48.97 72.75,48.97 IC3.43
  Bottom 0.203: IC4.6 35.66,38.71 37.19,38.71 v37.39,38.51 37.39,38.61 38.71,39.93 v59.23,39.93 59.44,39.93 91.44,7.92 92.46,7.92 TESTPIN.1
SDA  (via drill 0.41)
  Top 0.203: R12.2 97.23,12.29 96.72,12.29 95.71,11.28 94.28,11.28 93.47,10.46 92.46,10.46 TESTPIN.2 | v37.39,39.93 39.42,39.93 R6.1 39.42,40.03 39.62,40.23 39.62,40.95 40.74,42.06 47.24,42.06 50.19,39.12 57.4,39.12 v59.23,40.95 67.77,49.48 72.75,49.48 IC3.44
  Bottom 0.203: v37.39,39.93 37.29,39.93 37.19,40.03 35.66,40.03 IC4.5 | v59.23,40.95 81.89,18.29 83.62,18.29 91.44,10.46 92.46,10.46 TESTPIN.2
TXD0  (via drill 0.41)
  Top 0.203: 51.16,27.89 53.03,26.01 53.03,25.81 Q1.2 | 51.16,27.89 51.1,27.94 51.1,29.57 52.02,30.48 52.02,30.79 R3.1 52.12,30.89 52.12,32.21 54.25,34.34 54.25,35.05 54.71,35.51 | 54.71,35.51 53.34,36.88 52.32,36.88 51.92,37.29 Q3.3 | 54.71,35.51 54.81,35.41 | 54.81,35.41 55.37,34.85 55.37,34.34 R14.1 | 54.81,35.41 55.07,35.66 57.91,35.66 59.74,37.49 59.74,38.41 IC3.3 | v50.09,27.43 50.7,27.43 51.16,27.89
  Bottom 0.203: v50.09,27.43 35.87,13.21 8.64,13.21 8.43,13.41 8.23,13.21 7.11,13.21 6.91,13.41 6.81,13.41 6.6,13.21 6.5,13.21 6.2,13.51 6.2,13.61 5.38,14.43 5.08,14.43 PIHEADER.8
TXD1
  Top 0.203: IC3.46 72.85,50.49 74.07,50.49 87.58,36.98 87.58,16.87 91.44,13.01 92.46,13.01 TESTPIN.3
TXD3  (via drill 0.41)
  Top 0.203: v64.82,55.88 64.31,55.37 64.31,54.56 IC3.64
  Bottom 0.203: v64.82,55.88 79.65,55.88 97.64,37.9 98.55,37.9 J1.6
VBAT1
  Bottom 0.203: IC4.3 30.48,38.71 31.9,38.71 40.34,47.14 40.34,48.87 40.44,48.97 B2.+$1
VIN
  Top 0.61: 67.36,6.3 59.84,6.3 58.52,4.98 49.48,4.98 48.56,5.89 46.23,5.89 44.7,4.37 41.96,4.37 POWER.8
  pour Top: 67.38,5.55 67.38,4.16 67.43,4.11 67.69,3.84 69.05,3.84 69.79,4.58 69.79,7.46 71.58,9.25 72.93,9.25 72.98,9.3 72.98,11.76 74.64,13.42 75.66,13.42 76.59,14.36 76.59,16.71 76.05,17.25 73.06,17.25 71.32,18.99 69.69,18.99 69,18.3 69,12.08 68.31,11.38 68.31,7.75 67.36,6.8 67.36,5.59
XTAL1
  Top 0.203: 76.5,42.67 76.71,42.88 76.61,42.98 76.61,43.89 R1.1 | 76.5,42.67 76.5,40.64 Y1.3 | 76.5,42.67 76.1,42.67 74.27,44.5 72.85,44.5 IC3.34
XTAL2
  Top 0.203: R1.2 78.33,43.89 78.33,42.98 78.23,42.88 78.44,42.67 78.44,40.64 Y1.1 78.54,40.64 78.54,39.32 78.13,38.91 76.4,38.91 75.79,39.52 75.79,40.95 75.39,41.35 75.39,42.27 73.66,43.99 72.85,43.99 IC3.33